# EAGLE design Tonuino V1.0 (EAGLE 6.2)
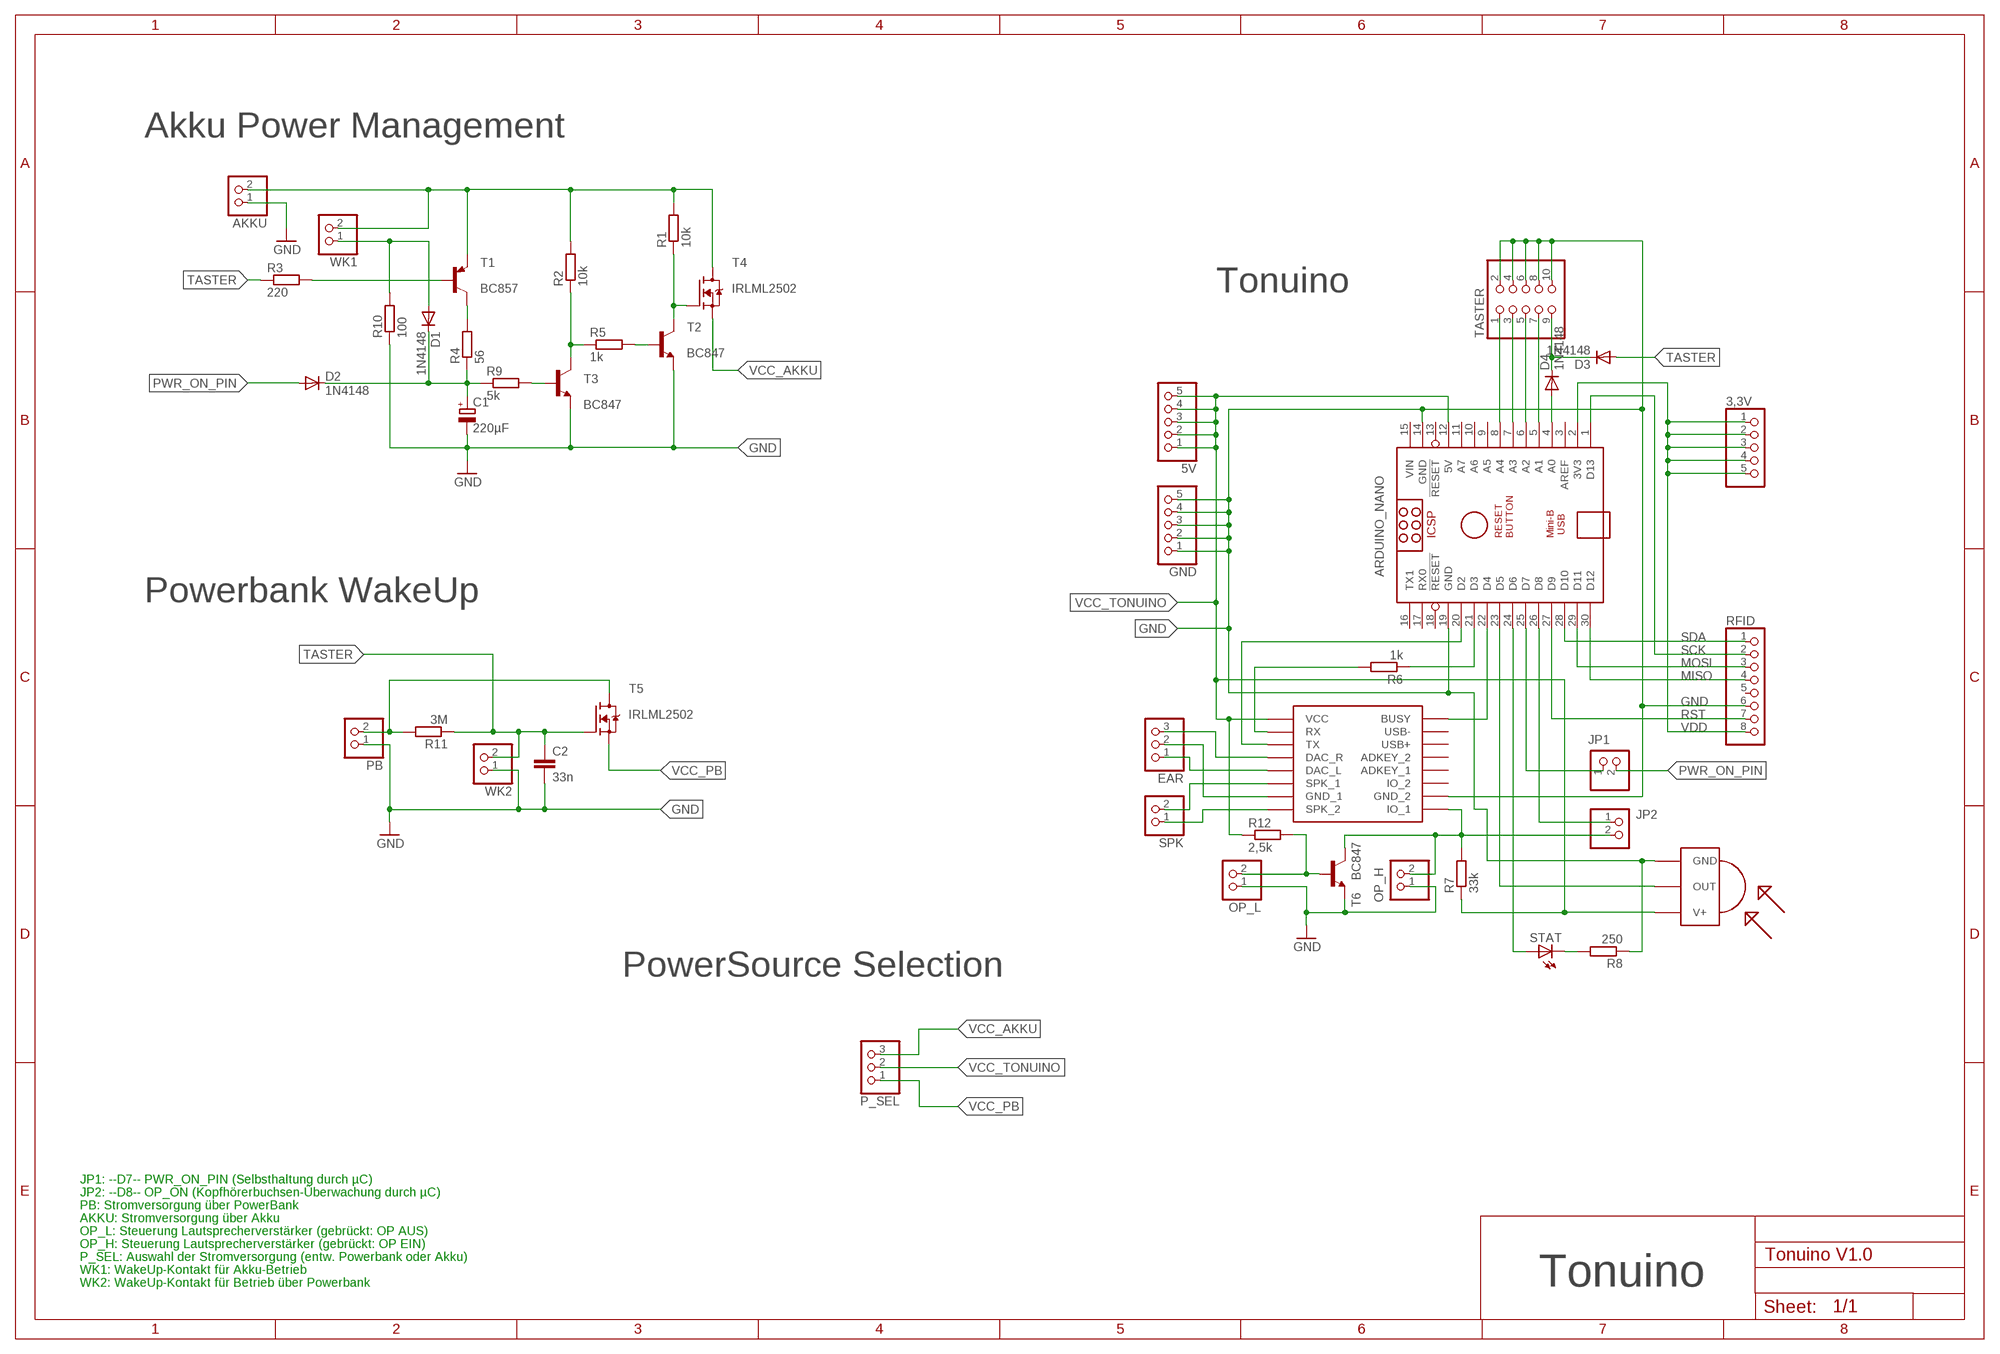
[diagram p0: schematic, sheet 1]

## Parts
3,3V  PINHD-1X5  [1X05]
5V  PINHD-1X5  [1X05]
AKKU  PINHD-1X2  [1X02]
ARDUINO_NANO  ARDUINO_NANO  [ARDUINO_NANO]
C1  220µF  CPOL-EUE5-13  [E5-13]
C2  33n  C-EUC0805  [C0805]
D1  1N4148  DIODE-SOD323-W  [SOD323-W]
D2  1N4148  DIODE-SOD323-W  [SOD323-W]
D3  1N4148  DIODE-SOD323-W  [SOD323-W]
D4  1N4148  DIODE-SOD323-W  [SOD323-W]
EAR  PINHD-1X3  [1X03]
GND  PINHD-1X5  [1X05]
JP1  PINHD-1X2  [1X02]
JP2  PINHD-1X2  [1X02]
OP_H  PINHD-1X2  [1X02]
OP_L  PINHD-1X2  [1X02]
P_SEL  PINHD-1X3  [1X03]
PB  PINHD-1X2  [1X02]
R1  10k  R-EU_R1206  [R1206]
R2  10k  R-EU_R1206  [R1206]
R3  220  R-EU_R1206  [R1206]
R4  56  R-EU_R1206  [R1206]
R5  1k  R-EU_R1206  [R1206]
R6  1k  R-EU_R1206  [R1206]
R7  33k  R-EU_R1206  [R1206]
R8  250  R-EU_R1206  [R1206]
R9  5k  R-EU_R1206  [R1206]
R10  100  R-EU_R1206  [R1206]
R11  3M  R-EU_R1206  [R1206]
R12  2,5k  R-EU_R1206  [R1206]
RFID  PINHD-1X8  [1X08]
SPK  PINHD-1X2  [1X02]
STAT  LED5MM  [LED5MM]
T1  BC857  BC857A-PNP-SOT23-BEC  [SOT23-BEC]
T2  BC847  [SOT23]
T3  BC847  [SOT23]
T4  IRLML2502  [SOT23]
T5  IRLML2502  [SOT23]
T6  BC847  [SOT23]
TASTER  PINHD-2X5  [2X05]
TSOP1  TSOP1730  [TSOP17XX]
U$2  DFPLAYER  [DFPLAYER]
WK1  PINHD-1X2  [1X02]
WK2  PINHD-1X2  [1X02]

## Nets
GND: AKKU.1 ARDUINO_NANO.14(GND) ARDUINO_NANO.19(GND) C1.- C2.2 GND.1 GND.2 GND.3 GND.4 GND.5 OP_H.1 OP_L.1 PB.1 R8.1 R10.1 RFID.6 T2.2(E) T3.2(E) T6.2(E) TASTER.2 TASTER.4 TASTER.6 TASTER.8 TASTER.10 TSOP1.GND U$2.GND_2 WK2.1
MISO: ARDUINO_NANO.30(D12) RFID.4
MOSI: ARDUINO_NANO.29(D11) RFID.3
N$1: SPK.1 U$2.SPK2(SPK_2)
N$2: SPK.2 U$2.SPK1(SPK_1)
N$3: EAR.2 U$2.GND_1
N$4: EAR.1 U$2.DAC_L
N$5: EAR.3 U$2.DAC_R
N$6: R6.2 U$2.RX
N$7: ARDUINO_NANO.21(D3) R6.1
N$8: ARDUINO_NANO.20(D2) U$2.TX
N$9: ARDUINO_NANO.22(D4) U$2.BUSY
N$10: JP2.2 OP_H.2 R7.2 T6.3(C) U$2.IO1(IO_1)
N$11: R3.2 T1.B
N$12: D3.C D4.C TASTER.9
N$13: ARDUINO_NANO.5(A1) TASTER.7
N$14: ARDUINO_NANO.6(A2) TASTER.5
N$15: ARDUINO_NANO.7(A3) TASTER.3
N$16: R8.2 STAT.K(C)
N$17: ARDUINO_NANO.26(D8) JP2.1
N$18: R4.2 T1.C
N$19: ARDUINO_NANO.8(A4) TASTER.1
N$20: PB.2 R11.2 T5.3(D)
N$21: ARDUINO_NANO.23(D5) TSOP1.OUT
N$22: ARDUINO_NANO.24(D6) STAT.A
N$23: OP_L.2 R12.2 T6.1(B)
N$24: C1.+ D1.C D2.C R4.1 R9.1
N$25: D1.A R10.2 WK1.1
N$28: ARDUINO_NANO.4(A0) D4.A
N$32: R9.2 T3.1(B)
N$33: R2.1 R5.1 T3.3(C)
N$34: R5.2 T2.1(B)
N$35: R1.1 T2.3(C) T4.1(G)
PWR_ON_PIN: D2.A JP1.2
PWR_ON_PIN_JPR: ARDUINO_NANO.25(D7) JP1.1
RST: ARDUINO_NANO.27(D9) RFID.7
SCK: ARDUINO_NANO.1(D13) RFID.2
SDA: ARDUINO_NANO.28(D10) RFID.1
TASTER: C2.1 D3.A R3.1 R11.1 T5.1(G) WK2.2
VCC: AKKU.2 R1.2 R2.2 T1.E T4.3(D) WK1.2
VCC_AKKU: P_SEL.3 T4.2(S)
VCC_PB: P_SEL.1 T5.2(S)
VCC_TONUINO: 5V.1 5V.2 5V.3 5V.4 5V.5 ARDUINO_NANO.12(5V) P_SEL.2 R7.1 R12.1 TSOP1.V+ U$2.VCC
VDD: 3,3V.1 3,3V.2 3,3V.3 3,3V.4 3,3V.5 ARDUINO_NANO.2(3V3) RFID.8
Unconnected: ARDUINO_NANO.3(AREF) ARDUINO_NANO.9(A5) ARDUINO_NANO.10(A6) ARDUINO_NANO.11(A7) ARDUINO_NANO.13(!RESET) ARDUINO_NANO.16(TX1) ARDUINO_NANO.17(RX0) ARDUINO_NANO.18(!RESET) RFID.5 U$2.ADKEY1(ADKEY_1) U$2.ADKEY2(ADKEY_2) U$2.IO2(IO_2) U$2.USB+ U$2.USB-

## Notes on the sheet
- Akku Power Management
- Tonuino
- Powerbank WakeUp
- PowerSource Selection
- JP1: --D7-- PWR_ON_PIN (Selbsthaltung durch µC)
- JP2: --D8-- OP_ON (Kopfhörerbuchsen-Überwachung durch µC)
- PB: Stromversorgung über PowerBank
- AKKU: Stromversorgung über Akku
- OP_L: Steuerung Lautsprecherverstärker (gebrückt: OP AUS)
- OP_H: Steuerung Lautsprecherverstärker (gebrückt: OP EIN)
- P_SEL: Auswahl der Stromversorgung (entw. Powerbank oder Akku)
- WK1: WakeUp-Kontakt für Akku-Betrieb
- WK2: WakeUp-Kontakt für Betrieb über Powerbank | Tonuino

## Power pins joined to a net without a drawn wire
VIN: ARDUINO_NANO.15(VIN)

## Library data of the parts
3,3V 5V GND = pinhead:PINHD-1X5: PIN HEADER
AKKU JP1 JP2 OP_H OP_L PB SPK WK1 WK2 = pinhead:PINHD-1X2: PIN HEADER
ARDUINO_NANO = ArduinoNanoV30:ARDUINO_NANO: Arduino Nano V3.0 Overview: The Arduino Nano is a small, complete, and breadboard-friendly board based on the ATmega328 (Arduino Nano 3.x) or ATmega168 (Arduino Nano 2.x). It has more or less the same functionality of the Arduino Duemilanove, but in a different package. It lacks only a DC power jack, and works with a Mini-B USB cable instead of a standard one. The Nano was designed and is being produced by Gravitech. Specifications: Microcontroller Atmel ATmega168 or ATmega328 Operating Voltage (logic level) 5 V Input Voltage (recommended) 7-12 V Input Voltage (limits) 6-20 V Digital I/O Pins 14 (of which 6 provide PWM output) Analog Input Pins 8 DC Current per I/O Pin 40 mA Flash Memory 16 KB (ATmega168) or 32 KB (ATmega328) of which 2 KB used by bootloader SRAM 1 KB (ATmega168) or 2 KB (ATmega328) EEPROM 512 bytes (ATmega168) or 1 KB (ATmega328) Clock Speed 16 MHz Dimensions 0.73" x 1.70" Length 45 mm Width 18 mm Weigth 5 g Power: The Arduino Nano can be powered via the Mini-B USB connection, 6-20V unregulated external power supply (pin 30), or 5V regulated external power supply (pin 27). The power source is automatically selected to the highest voltage source. Memory: The ATmega168 has 16 KB of flash memory for storing code (of which 2 KB is used for the bootloader); the ATmega328 has 32 KB, (also with 2 KB used for the bootloader). The ATmega168 has 1 KB of SRAM and 512 bytes of EEPROM (which can be read and written with the EEPROM library); the ATmega328 has 2 KB of SRAM and 1 KB of EEPROM. Input and Output: Each of the 14 digital pins on the Nano can be used as an input or output, using pinMode(), digitalWrite(), and digitalRead() functions. They operate at 5 volts. Each pin can provide or receive a maximum of 40 mA and has an internal pull-up resistor (disconnected by default) of 20-50 kOhms. In addition, some pins have specialized functions. Visit Arduino - ArduinoBoardNano <https://www.arduino.cc/en/Main/ArduinoBoardNano>
C1 = rcl:CPOL-EU: POLARIZED CAPACITOR, European symbol
C2 = rcl:C-EU: CAPACITOR, European symbol
D1-D4 = diode:DIODE-: DIODE
EAR P_SEL = pinhead:PINHD-1X3: PIN HEADER
R1-R12 = rcl:R-EU_: RESISTOR, European symbol
RFID = pinhead:PINHD-1X8: PIN HEADER
STAT = led:LED: LED OSRAM: - CHIPLED LG R971, LG N971, LY N971, LG Q971, LY Q971, LO R971, LY R971 LH N974, LH R974 LS Q976, LO Q976, LY Q976 LO Q996 - Hyper CHIPLED LW Q18S LB Q993, LB Q99A, LB R99A - SideLED LS A670, LO A670, LY A670, LG A670, LP A670 LB A673, LV A673, LT A673, LW A673 LH A674 LY A675 LS A676, LA A676, LO A676, LY A676, LW A676 LS A679, LY A679, LG A679 - Hyper Micro SIDELED® LS Y876, LA Y876, LO Y876, LY Y876 LT Y87S - SmartLED LW L88C, LW L88S LB L89C, LB L89S, LG L890 LS L89K, LO L89K, LY L89K LS L896, LA L896, LO L896, LY L896 - TOPLED LS T670, LO T670, LY T670, LG T670, LP T670 LSG T670, LSP T670, LSY T670, LOP T670, LYG T670 LG T671, LOG T671, LSG T671 LB T673, LV T673, LT T673, LW T673 LH T674 LS T676, LA T676, LO T676, LY T676, LB T676, LH T676, LSB T676, LW T676 LB T67C, LV T67C, LT T67C, LS T67K, LO T67K, LY T67K, LW E67C LS E67B, LA E67B, LO E67B, LY E67B, LB E67C, LV E67C, LT E67C LW T67C LS T679, LY T679, LG T679 LS T770, LO T770, LY T770, LG T770, LP T770 LB T773, LV T773, LT T773, LW T773 LH T774 LS E675, LA E675, LY E675, LS T675 LS T776, LA T776, LO T776, LY T776, LB T776 LHGB T686 LT T68C, LB T68C - Hyper Mini TOPLED® LB M676 - Mini TOPLED Santana® LG M470 LS M47K, LO M47K, LY M47K Source: http://www.osram.convergy.de LUXEON: - LUMILED® LXK2-PW12-R00, LXK2-PW12-S00, LXK2-PW14-U00, LXK2-PW14-V00 LXK2-PM12-R00, LXK2-PM12-S00, LXK2-PM14-U00 LXK2-PE12-Q00, LXK2-PE12-R00, LXK2-PE12-S00, LXK2-PE14-T00, LXK2-PE14-U00 LXK2-PB12-K00, LXK2-PB12-L00, LXK2-PB12-M00, LXK2-PB14-N00, LXK2-PB14-P00, LXK2-PB14-Q00 LXK2-PR12-L00, LXK2-PR12-M00, LXK2-PR14-Q00, LXK2-PR14-R00 LXK2-PD12-Q00, LXK2-PD12-R00, LXK2-PD12-S00 LXK2-PH12-R00, LXK2-PH12-S00 LXK2-PL12-P00, LXK2-PL12-Q00, LXK2-PL12-R00 Source: www.luxeon.com KINGBRIGHT: KA-3528ASYC Source: www.kingbright.com
T1 = transistor:*-PNP-: PNP Transistror
T2 T3 T6 = transistor:BC847: NPN TRANSISTOR
T4 T5 = transistor-fet:IRLML2502
TASTER = pinhead:PINHD-2X5: PIN HEADER
TSOP1 = tsop:TSOP1730: IR Receiver and Demodulator
U$2 = DFPlayer_v1:DFPLAYER

## Board
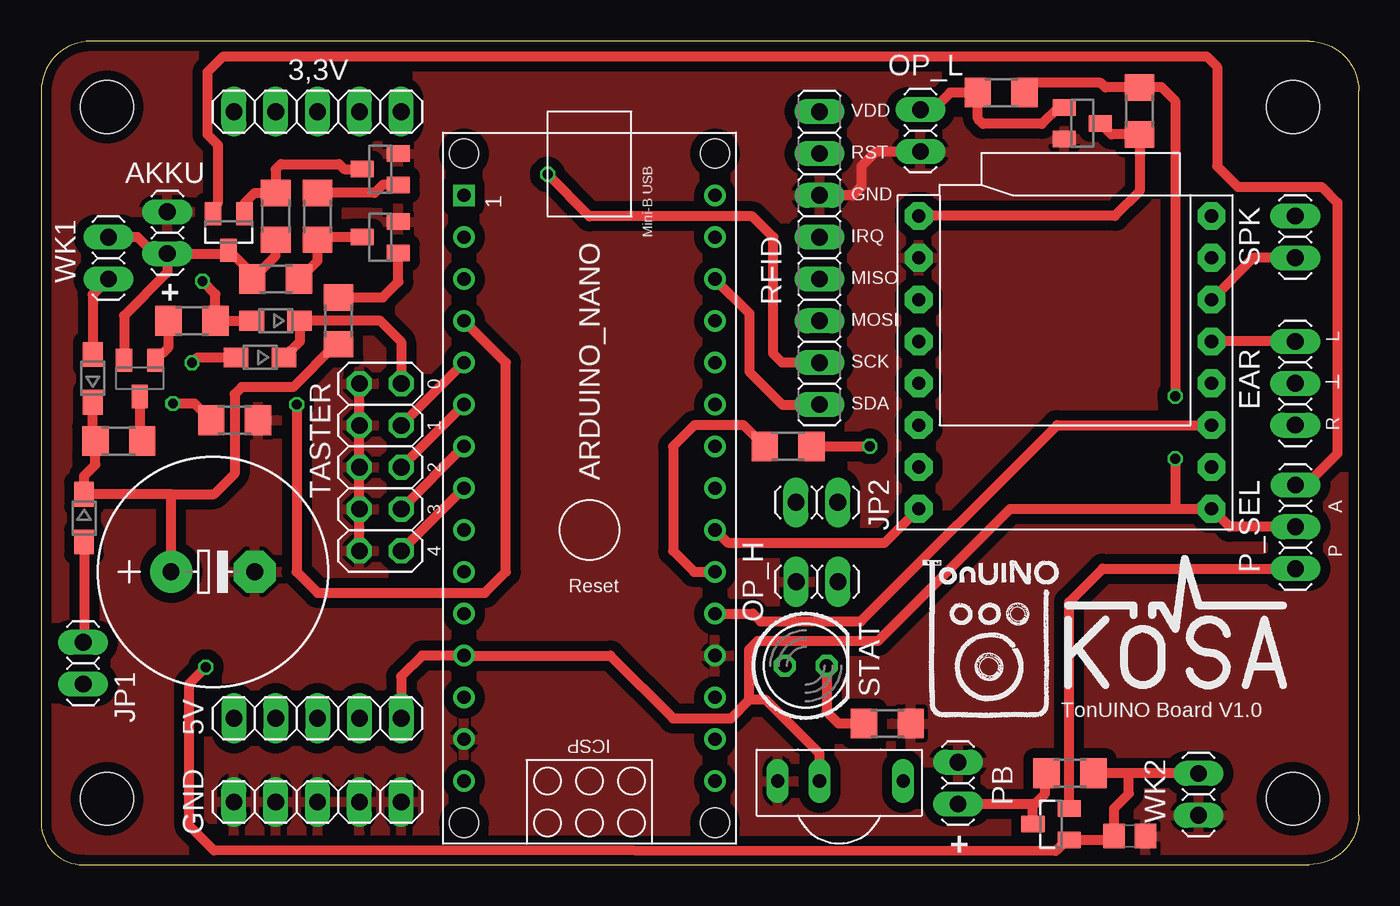
[diagram p1: board, top side]
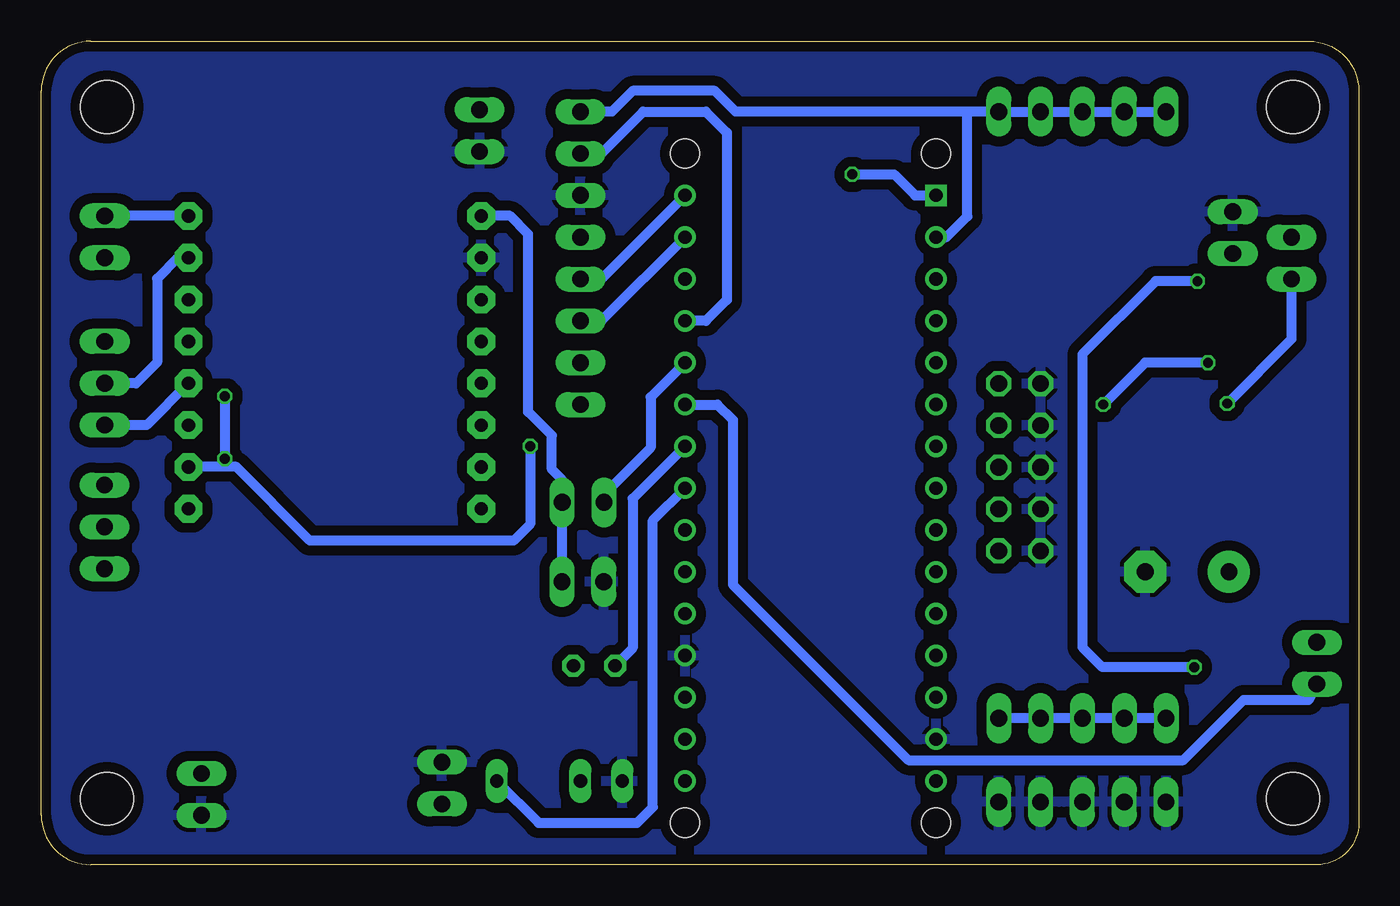
[diagram p2: board, bottom side, seen from below]

Size 80 x 50 mm. Coordinates in mm from the lower left corner, seen from the top.
Outline: 0,47 0,2.54 arc90 2.54,0 77,0 arc90 80,3 80,47 arc90 77,50 3,50 arc90 0,47
Copper layers (1*16): Top 0.035mm / dielectric 1.5mm / Bottom 0.035mm
Design rules: minimum track width 6mil, minimum drill 12mil, track to track 6mil, track to pad 6mil, pad to pad 6mil, via to via 6mil, smd to smd 0mil, copper to edge 10mil, drill to drill 10mil, minimum pad ring 10mil, minimum via ring 6mil, stop-mask expansion 2mil, vias tented up to drill 100mil, thermal gap 10mil
Holes 3.2 mm at 4,46 4,4 76,46 76,4

### Footprints (pad centres in the part's own frame; a part is rotated, then mirrored left to right if it is on the bottom)
1X05 = drill 1.016 long: 1 -5.08,0; 2 -2.54,0; 3 0,0; 4 2.54,0; 5 5.08,0
1X02 = drill 1.016 long: 1 -1.27,0; 2 1.27,0
ARDUINO_NANO = drill 0.8 square: 1 -20.32,-7.62 | drill 0.8: 2 -17.78,-7.62; 3 -15.24,-7.62; 4 -12.7,-7.62; 5 -10.16,-7.62; 6 -7.62,-7.62; 7 -5.08,-7.62; 8 -2.54,-7.62; 9 0,-7.62; 10 2.54,-7.62; 11 5.08,-7.62; 12 7.62,-7.62; 13 10.16,-7.62; 14 12.7,-7.62; 15 15.24,-7.62; 16 15.24,7.62; 17 12.7,7.62; 18 10.16,7.62; 19 7.62,7.62; 20 5.08,7.62; 21 2.54,7.62; 22 0,7.62; 23 -2.54,7.62; 24 -5.08,7.62; 25 -7.62,7.62; 26 -10.16,7.62; 27 -12.7,7.62; 28 -15.24,7.62; 29 -17.78,7.62; 30 -20.32,7.62 | hole 1.778: -22.86,-7.62; -22.86,7.62; 17.78,7.62; 17.78,-7.62
E5-13 = drill 1.016 pad 2.54: + -2.54,0 | drill 1.016 pad 2.54 octagon: - 2.54,0
C0805 = smd 1.3 x 1.5: 1 -0.95,0; 2 0.95,0
SOD323-W = smd 1.5 x 1.2: A 1.45,0; C -1.45,0
1X03 = drill 1.016 long: 1 -2.54,0; 2 0,0; 3 2.54,0
R1206 = smd 1.6 x 1.803: 1 -1.422,0; 2 1.422,0
1X08 = drill 1.016 long: 1 -8.89,0; 2 -6.35,0; 3 -3.81,0; 4 -1.27,0; 5 1.27,0; 6 3.81,0; 7 6.35,0; 8 8.89,0
LED5MM = drill 0.813 octagon: A -1.27,0; K 1.27,0
SOT23-BEC = smd 1 x 1.4: B -0.95,-1.1; C 0,1.1; E 0.95,-1.1
SOT23 = smd 1 x 1.4: 1 -0.95,-1.1; 2 0.95,-1.1; 3 0,1.1
2X05 = drill 1.016 octagon: 1 -5.08,-1.27; 2 -5.08,1.27; 3 -2.54,-1.27; 4 -2.54,1.27; 5 0,-1.27; 6 0,1.27; 7 2.54,-1.27; 8 2.54,1.27; 9 5.08,-1.27; 10 5.08,1.27
TSOP17XX = drill 0.813 long: GND -3.81,0; OUT 3.81,0; V+ -1.27,0
DFPLAYER = drill 0.8 pad 1.676 octagon: ADKEY1 8.89,-1.27; ADKEY2 8.89,1.27; BUSY 8.89,8.89; DAC_L -8.89,-1.27; DAC_R -8.89,1.27; GND_1 -8.89,-6.35; GND_2 8.89,-6.35; IO1 8.89,-8.89; IO2 8.89,-3.81; RX -8.89,6.35; SPK1 -8.89,-3.81; SPK2 -8.89,-8.89; TX -8.89,3.81; USB+ 8.89,3.81; USB- 8.89,6.35; VCC -8.89,8.89

### Placement (x,y rotation side)
3,3V  16.78,45.72 0 top
5V  16.78,8.89 180 top
AKKU  7.66,38.37 270 top
ARDUINO_NANO  33.29,20.32 270 top
C1  10.43,17.78 0 top
C2  66.09,1.74 0 top
D1  3.13,29.53 90 top
D2  2.6,21.05 270 top
D3  14.24,33.02 180 top
D4  13.29,30.8 180 top
EAR  76.14,29.23 270 top
GND  16.78,3.81 0 top
JP1  2.55,12.24 90 top
JP2  47.09,22 0 top
OP_H  47.11,17.18 0 top
OP_L  53.38,44.57 90 top
P_SEL  76.15,20.51 90 top
PB  55.66,4.96 270 top
R1  14.24,39.37 270 top
R2  14.24,35.56 180 top
R3  9.16,33.02 180 top
R4  4.71,25.72 0 top
R5  16.78,39.37 90 top
R6  45.35,25.4 0 top
R7  66.69,45.77 270 top
R8  51.38,8.57 180 top
R9  18.05,33.02 90 top
R10  11.75,26.99 180 top
R11  62.46,5.56 180 top
R12  58.29,46.87 180 top
RFID  47.26,36.83 90 top
SPK  76.14,38.12 270 top
STAT  46.42,12.08 0 top
T1  5.99,29.53 180 top
T2  20.59,42.23 90 top
T3  20.59,38.1 90 top
T4  11.38,38.42 180 top
T5  61.32,2.46 90 top
T6  63.21,45.01 270 top
TASTER  20.59,24.13 90 top
TSOP1  48.53,5.08 0 top
U$2  62.17,30.5 180 top
WK1  4.08,36.83 90 top
WK2  70.27,4.27 90 top

### Tracks (layer width: path | path; a pad name or v marks a point on that pad's centre or on a via)
GND
  Top 0.61: TASTER.2 TASTER.4 TASTER.6 TASTER.8 TASTER.10 | OP_L.1 50.68,43.3 49.8,42.42 49.8,41.15 49.29,40.64 RFID.6
  pour Bottom (isolate 0.61): 0,50 80,50 80,0 0,0
  pour Top (isolate 0.61): 0,50 80,50 80,0 0,0
MISO
  Bottom 0.61: RFID.4 45.99,35.56 ARDUINO_NANO.30
MOSI
  Bottom 0.61: ARDUINO_NANO.29 45.99,33.02 RFID.3
N$1
  Bottom 0.61: U$2.SPK2 SPK.1
N$2
  Top 0.61: SPK.2 73.6,36.85 U$2.SPK1
N$3
  Bottom 0.61: U$2.GND_1 71.69,36.85 72.96,35.58 72.96,30.5 74.23,29.23 EAR.2
N$4
  Top 0.61: EAR.1 U$2.DAC_L
N$5
  Bottom 0.61: U$2.DAC_R 73.6,26.69 EAR.3
N$6  (via drill 0.6)
  Top 0.61: R6.2 v50.32,25.4
  Bottom 0.61: v50.32,25.4 50.32,20.68 51.32,19.68 63.68,19.68 68.15,24.15 U$2.RX
N$7
  Top 0.61: R6.1 42.66,26.67 39.64,26.67 38.37,25.4 38.37,19.05 39.64,17.78 ARDUINO_NANO.21
N$8
  Top 0.61: U$2.TX 61.69,26.69 49.77,14.77 43.68,14.77 43.21,15.24 ARDUINO_NANO.20
N$9
  Top 0.61: ARDUINO_NANO.22 41.67,19.56 51.23,19.56 U$2.BUSY
N$10
  Top 0.61: U$2.IO1 65.18,39.39 66.68,40.89 R7.2 64.98,44.34 T6.3
  Bottom 0.61: U$2.IO1 51.53,39.39 50.43,38.29 50.43,27.5 49,26.06 49,24 48.36,23.37 JP2.2 48.36,17.5 OP_H.2
N$11
  Top 0.61: 7.42,33.34 arc-90 R3.2 7.74,31.43 T1.B
N$12
  Top 0.61: D4.C 15.69,31.75 D3.C 20.59,33.02 21.86,31.75 TASTER.9
N$13
  Top 0.61: ARDUINO_NANO.5 TASTER.7
N$14
  Top 0.61: ARDUINO_NANO.6 TASTER.5
N$15
  Top 0.61: ARDUINO_NANO.7 TASTER.3
N$16
  Top 0.61: STAT.K 47.69,9.29 48.41,8.57 R8.2
N$17
  Bottom 0.61: ARDUINO_NANO.26 43,28.39 43,25.32 45.82,22.49 JP2.1
N$18
  Top 0.61: T1.C 5.98,25.87 R4.2
N$19
  Top 0.61: ARDUINO_NANO.8 TASTER.1
N$20
  Top 0.61: T5.3 60.22,3.58 60.32,3.68 | 60.32,3.68 60.96,4.32 60.96,5.48 R11.2 | PB.2 60.31,3.69 60.32,3.68
N$21
  Bottom 0.61: TSOP1.OUT 49.8,2.54 43.81,2.54 42.86,3.49 42.86,20.91 ARDUINO_NANO.23
N$22
  Bottom 0.61: ARDUINO_NANO.24 44.08,22.23 44.08,13.15 STAT.A
N$23
  Top 0.61: OP_L.2 54.15,45.84 55.18,46.88 R12.2 56.87,45.3 57.18,44.99 60.76,44.99 61.74,45.96 T6.1
N$24
  Top 0.61: R9.1 17.9,31.6 15.3,29 12.17,29 11.75,28.58 11.75,23.75 10.49,22.5 7.89,22.5 | C1.+ 7.89,22.5 | D1.C 3.13,25.88 R4.1 3.29,24.29 2.6,23.61 D2.C 7.89,22.5
N$25  (via drill 0.6)
  Top 0.61: WK1.1 3.13,34.61 D1.A | R10.2 9.31,28 v8,28
  Bottom 0.61: v8,28 4.08,31.92 WK1.1
N$28  (via drill 0.6)
  Top 0.61: v9.16,30.48 9.48,30.8 D4.A | v15.51,27.94 15.51,17.78 16.78,16.51 26.94,16.51 28.21,17.78 28.21,30.48 ARDUINO_NANO.4
  Bottom 0.61: v9.16,30.48 12.97,30.48 v15.51,27.94
N$32
  Top 0.61: R9.2 20.74,34.44 21.69,35.39 T3.1
N$33
  Top 0.61: R2.1 16.78,36.68 R5.1 arc-90 16.93,38.1 T3.3
N$34
  Top 0.61: R5.2 20.25,40.79 20.74,41.28 T2.1
N$35
  Top 0.61: T4.1 12.33,40.15 12.97,40.79 R1.1 14.24,42.22 14.56,42.54 18.09,42.54 18.4,42.23 T2.3
PWR_ON_PIN
  Top 0.61: D2.A 2.6,13.51 JP1.2
PWR_ON_PIN_JPR
  Bottom 0.61: ARDUINO_NANO.25 38.94,27.94 38,27 38,17 27.35,6.35 10.65,6.35 7,10 3.05,10 JP1.1
RST
  Bottom 0.61: RFID.7 45.99,43.18 43.45,45.72 39.64,45.72 38.37,44.45 38.37,34.29 39.64,33.02 ARDUINO_NANO.27
SCK  (via drill 0.6)
  Top 0.61: RFID.2 44.99,30.48 44.45,31.02 44.45,38.1 43.18,39.37 33.29,39.37 v30.75,41.91
  Bottom 0.61: v30.75,41.91 28.21,41.91 26.94,40.64 ARDUINO_NANO.1
SDA
  Top 0.61: RFID.1 44.99,27.94 43,29.93 43,33.47 ARDUINO_NANO.28
TASTER  (via drill 0.6)
  Top 0.61: D3.A R3.1 10.58,34.65 v9.79,35.44 | WK2.2 70.25,5.56 66.04,5.56 | 66.04,5.56 R11.1 | 66.04,5.56 66.04,4.32 65.14,3.42 C2.1 64.91,1.51 T5.1 62.28,1.51 61.59,0.83 10.49,0.88 9,2.37 9,11 v10,12
  Bottom 0.61: v9.79,35.44 12.33,35.44 16.78,30.99 16.78,13.21 15.57,12 v10,12
VCC
  Top 0.61: R1.2 14.24,36.98 R2.2 12.82,35.88 T4.3 | T1.E 5.03,33.34 7.66,35.96 AKKU.2 | WK1.2 5.86,38.1 6.86,37.1 AKKU.2 | T4.3 11.36,37.34 | AKKU.2 11.17,37.1 T4.3
VCC_AKKU
  Top 0.61: P_SEL.3 76.79,23.05 78.69,24.96 78.69,40.2 77.74,41.15 72.66,41.15 71.39,42.42 71.39,48.45 70.75,49.08 11.06,49.08 10.11,48.13 10.11,44.33 10.75,43.69 10.75,40.2 10.43,39.88 T4.2
VCC_PB
  Top 0.61: T5.2 62.42,15.94 64.45,17.97 P_SEL.1
VCC_TONUINO  (via drill 0.6)
  Top 0.61: 5V.1 21.86,11.43 23.13,12.7 ARDUINO_NANO.12 34.56,12.7 38.37,8.89 41.89,8.89 43,10 | 43,10 43,13.1 43.5,13.59 50.82,13.59 58.83,21.61 68.85,21.61 | TSOP1.V+ 47.26,6.74 44,10 43,10 | 68.85,21.61 U$2.VCC 72.16,20.51 P_SEL.2 | v68.85,28.45 68.85,46.37 68.03,47.19 R7.1 64.63,47.19 64.34,47.47 60.31,47.47 R12.1 | v68.85,24.64 68.85,21.61
  Bottom 0.61: 5V.5 5V.4 5V.3 5V.2 5V.1 | v68.85,28.45 v68.85,24.64
VDD
  Bottom 0.61: 3,3V.1 3,3V.2 3,3V.3 3,3V.4 3,3V.5 23.76,45.72 | 23.76,45.72 37.83,45.72 39.1,46.99 44.08,46.99 45.35,45.72 RFID.8 | ARDUINO_NANO.2 25.03,38.1 23.76,39.37 23.76,45.72

### Text on the board
tPlace: VDD | RST | GND | IRQ | MISO | MOSI | L | SCK | 0 | SDA | 1 | R | 2 | 3 | 4
tNames: + | A | P | TonUINO Board V1.0 | +